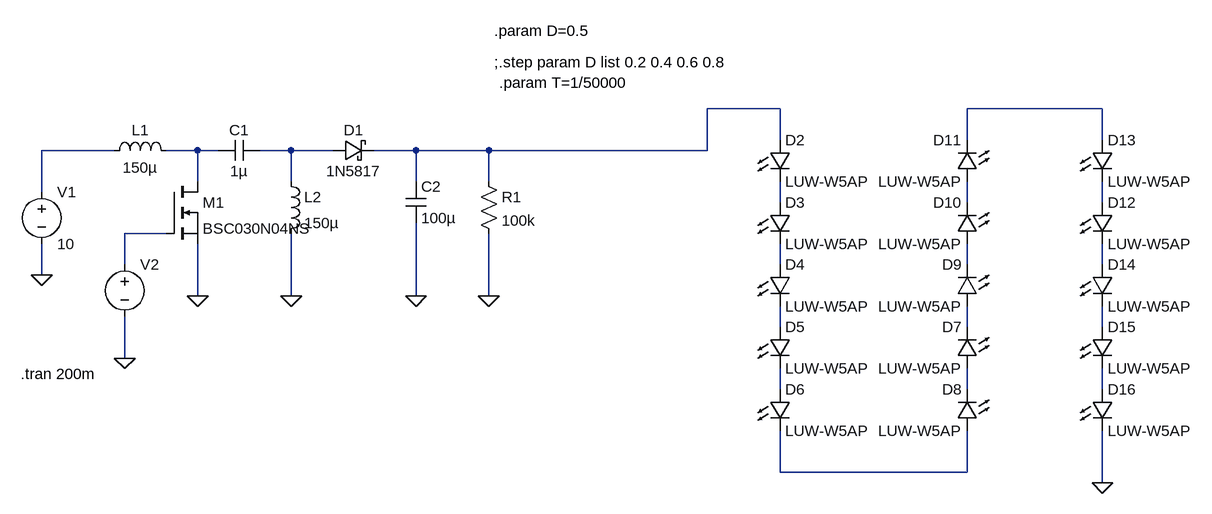
[diagram p0: schematic SEPIC.asc]
SEPIC.asc, the LTspice schematic file:
Version 4
SHEET 1 1712 680
WIRE 1072 0 960 0
WIRE 1568 0 1360 0
WIRE 1072 48 1072 0
WIRE 1360 48 1360 0
WIRE 1568 48 1568 0
WIRE 48 64 -64 64
WIRE 176 64 128 64
WIRE 208 64 176 64
WIRE 320 64 272 64
WIRE 384 64 320 64
WIRE 512 64 448 64
WIRE 624 64 512 64
WIRE 960 64 960 0
WIRE 960 64 624 64
WIRE 176 112 176 64
WIRE 320 112 320 64
WIRE 512 112 512 64
WIRE 624 112 624 64
WIRE -64 128 -64 64
WIRE 1072 144 1072 112
WIRE 1360 144 1360 112
WIRE 1568 144 1568 112
WIRE 128 192 64 192
WIRE 64 240 64 192
WIRE 1072 240 1072 208
WIRE 1360 240 1360 208
WIRE 1568 240 1568 208
WIRE -64 256 -64 208
WIRE 176 288 176 208
WIRE 320 288 320 192
WIRE 512 288 512 176
WIRE 624 288 624 192
WIRE 1072 336 1072 304
WIRE 1360 336 1360 304
WIRE 1568 336 1568 304
WIRE 64 384 64 320
WIRE 1072 432 1072 400
WIRE 1360 432 1360 400
WIRE 1568 432 1568 400
WIRE 1072 560 1072 496
WIRE 1360 560 1360 496
WIRE 1360 560 1072 560
WIRE 1568 576 1568 496
FLAG -64 256 0
FLAG 64 384 0
FLAG 176 288 0
FLAG 320 288 0
FLAG 512 288 0
FLAG 624 288 0
FLAG 1568 576 0
SYMBOL voltage -64 112 R0
WINDOW 123 0 0 Left 0
WINDOW 39 0 0 Left 0
SYMATTR InstName V1
SYMATTR Value 10
SYMBOL ind 32 80 R270
WINDOW 0 32 56 VTop 2
WINDOW 3 5 56 VBottom 2
SYMATTR InstName L1
SYMATTR Value 150µ
SYMATTR SpiceLine Rser=10
SYMBOL cap 272 48 R90
WINDOW 0 0 32 VBottom 2
WINDOW 3 32 32 VTop 2
SYMATTR InstName C1
SYMATTR Value 1µ
SYMBOL ind 304 96 R0
SYMATTR InstName L2
SYMATTR Value 150µ
SYMATTR SpiceLine Rser=10
SYMBOL schottky 384 80 R270
WINDOW 0 32 32 VTop 2
WINDOW 3 0 32 VBottom 2
SYMATTR InstName D1
SYMATTR Value 1N5817
SYMATTR Description Diode
SYMATTR Type diode
SYMBOL cap 496 112 R0
SYMATTR InstName C2
SYMATTR Value 100µ
SYMBOL res 608 96 R0
SYMATTR InstName R1
SYMATTR Value 100k
SYMBOL nmos 128 112 R0
SYMATTR InstName M1
SYMATTR Value BSC030N04NS
SYMBOL voltage 64 224 R0
WINDOW 3 24 96 Invisible 2
WINDOW 123 0 0 Left 0
WINDOW 39 0 0 Left 0
SYMATTR Value PULSE(0 10 1u 5n 5n {D*T} {T})
SYMATTR InstName V2
SYMBOL LED 1056 144 R0
SYMATTR InstName D3
SYMATTR Value LUW-W5AP
SYMBOL LED 1056 48 R0
SYMATTR InstName D2
SYMATTR Value LUW-W5AP
SYMBOL LED 1056 240 R0
SYMATTR InstName D4
SYMATTR Value LUW-W5AP
SYMBOL LED 1056 336 R0
SYMATTR InstName D5
SYMATTR Value LUW-W5AP
SYMBOL LED 1056 432 R0
SYMATTR InstName D6
SYMATTR Value LUW-W5AP
SYMBOL LED 1376 400 R180
WINDOW 0 24 64 Left 2
WINDOW 3 24 0 Left 2
SYMATTR InstName D7
SYMATTR Value LUW-W5AP
SYMBOL LED 1376 496 R180
WINDOW 0 24 64 Left 2
WINDOW 3 24 0 Left 2
SYMATTR InstName D8
SYMATTR Value LUW-W5AP
SYMBOL LED 1376 304 R180
WINDOW 0 24 64 Left 2
WINDOW 3 24 0 Left 2
SYMATTR InstName D9
SYMATTR Value LUW-W5AP
SYMBOL LED 1376 208 R180
WINDOW 0 24 64 Left 2
WINDOW 3 24 0 Left 2
SYMATTR InstName D10
SYMATTR Value LUW-W5AP
SYMBOL LED 1376 112 R180
WINDOW 0 24 64 Left 2
WINDOW 3 24 0 Left 2
SYMATTR InstName D11
SYMATTR Value LUW-W5AP
SYMBOL LED 1552 144 R0
SYMATTR InstName D12
SYMATTR Value LUW-W5AP
SYMBOL LED 1552 48 R0
SYMATTR InstName D13
SYMATTR Value LUW-W5AP
SYMBOL LED 1552 240 R0
SYMATTR InstName D14
SYMATTR Value LUW-W5AP
SYMBOL LED 1552 336 R0
SYMATTR InstName D15
SYMATTR Value LUW-W5AP
SYMBOL LED 1552 432 R0
SYMATTR InstName D16
SYMATTR Value LUW-W5AP
TEXT 632 -72 Left 2 !;.step param D list 0.2 0.4 0.6 0.8
TEXT 640 -40 Left 2 !.param T=1/50000
TEXT -96 408 Left 2 !.tran 200m
TEXT 632 -120 Left 2 !.param D=0.5

The netlist it stands for:
* SEPIC.asc
V1 N003 0 10
L1 N003 N004 150µ Rser=10
C1 N005 N004 1µ
L2 N005 0 150µ Rser=10
D1 N005 N001 1N5817
C2 N001 0 100µ
R1 N001 0 100k
M1 N004 N009 0 0 BSC030N04NS
V2 N009 0 PULSE(0 10 1u 5n 5n {D*T} {T})
D3 N006 N010 LUW-W5AP
D2 N001 N006 LUW-W5AP
D4 N010 N013 LUW-W5AP
D5 N013 N016 LUW-W5AP
D6 N016 N019 LUW-W5AP
D7 N017 N014 LUW-W5AP
D8 N019 N017 LUW-W5AP
D9 N014 N011 LUW-W5AP
D10 N011 N007 LUW-W5AP
D11 N007 N002 LUW-W5AP
D12 N008 N012 LUW-W5AP
D13 N002 N008 LUW-W5AP
D14 N012 N015 LUW-W5AP
D15 N015 N018 LUW-W5AP
D16 N018 0 LUW-W5AP
.model D D
.lib standard.dio
.model NMOS NMOS
.model PMOS PMOS
.lib standard.mos
;.step param D list 0.2 0.4 0.6 0.8
.param T=1/50000
.tran 200m
.param D=0.5
.backanno
.end